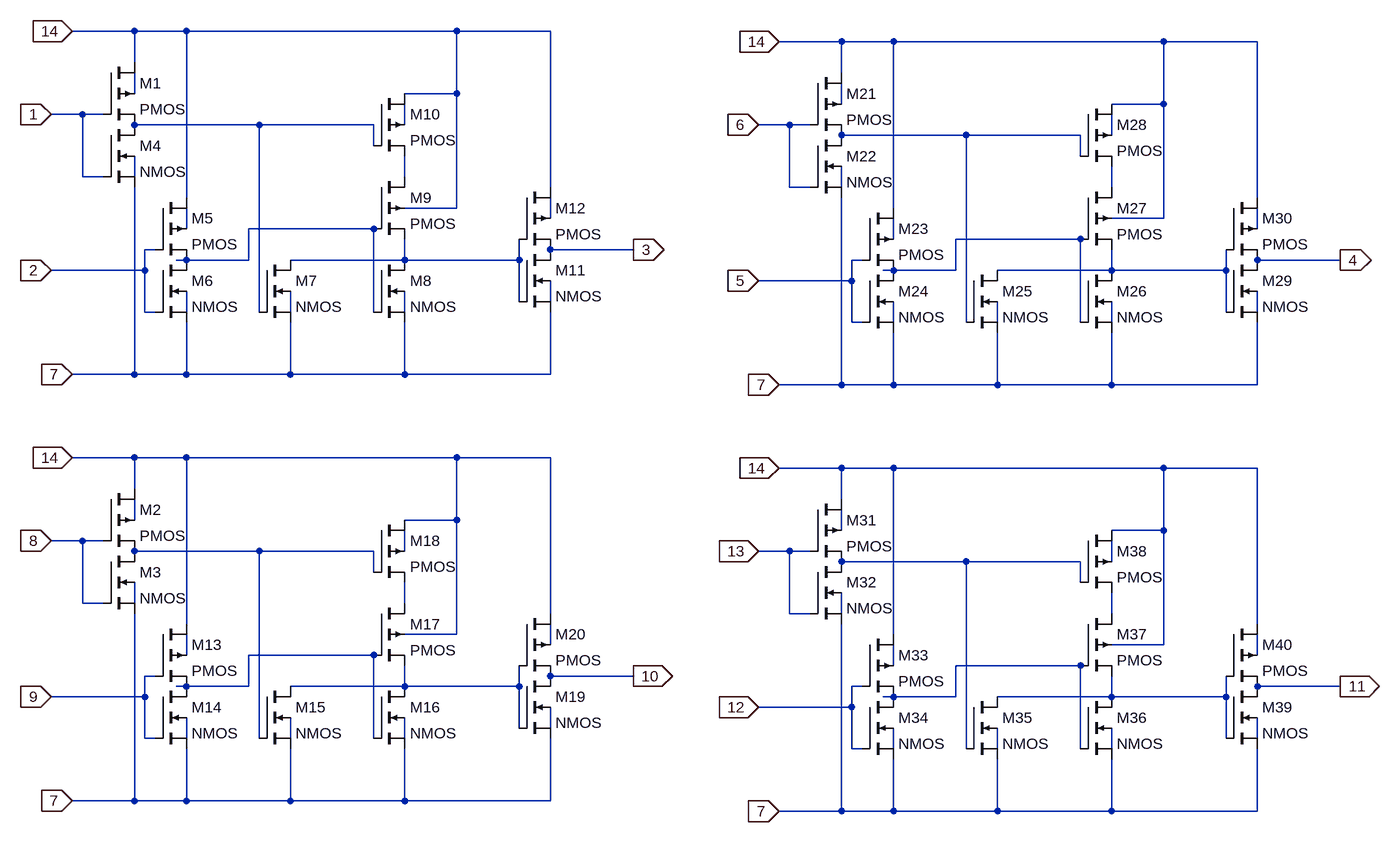
[diagram p0: schematic 4011_NAND.asc]
4011_NAND.asc, the LTspice schematic file:
Version 4
SHEET 1 2200 1208
WIRE 256 -64 160 -64
WIRE 336 -64 256 -64
WIRE 752 -64 336 -64
WIRE 896 -64 752 -64
WIRE 1344 -48 1248 -48
WIRE 1424 -48 1344 -48
WIRE 1840 -48 1424 -48
WIRE 1984 -48 1840 -48
WIRE 256 -16 256 -64
WIRE 1344 0 1344 -48
WIRE 256 32 256 0
WIRE 752 32 752 -64
WIRE 752 32 672 32
WIRE 1344 48 1344 16
WIRE 1840 48 1840 -48
WIRE 1840 48 1760 48
WIRE 176 64 128 64
WIRE 208 64 176 64
WIRE 448 80 256 80
WIRE 624 80 448 80
WIRE 672 80 672 48
WIRE 1264 80 1216 80
WIRE 1296 80 1264 80
WIRE 1536 96 1344 96
WIRE 1712 96 1536 96
WIRE 1760 96 1760 64
WIRE 624 112 624 80
WIRE 1712 128 1712 96
WIRE 176 160 176 64
WIRE 208 160 176 160
WIRE 256 160 256 128
WIRE 672 160 672 128
WIRE 896 176 896 -64
WIRE 1264 176 1264 80
WIRE 1296 176 1264 176
WIRE 1344 176 1344 144
WIRE 1760 176 1760 144
WIRE 336 192 336 -64
WIRE 1984 192 1984 -48
WIRE 752 208 752 32
WIRE 752 208 672 208
WIRE 1424 208 1424 -48
WIRE 896 224 896 192
WIRE 1840 224 1840 48
WIRE 1840 224 1760 224
WIRE 336 240 336 208
WIRE 624 240 432 240
WIRE 1984 240 1984 208
WIRE 1424 256 1424 224
WIRE 1712 256 1520 256
WIRE 288 272 272 272
WIRE 1024 272 896 272
WIRE 336 288 320 288
WIRE 432 288 432 240
WIRE 432 288 336 288
WIRE 672 288 672 256
WIRE 672 288 496 288
WIRE 848 288 848 256
WIRE 848 288 672 288
WIRE 1376 288 1360 288
WIRE 2112 288 1984 288
WIRE 272 304 272 272
WIRE 272 304 128 304
WIRE 1424 304 1408 304
WIRE 1520 304 1520 256
WIRE 1520 304 1424 304
WIRE 1760 304 1760 272
WIRE 1760 304 1584 304
WIRE 1936 304 1936 272
WIRE 1936 304 1760 304
WIRE 1360 320 1360 288
WIRE 1360 320 1216 320
WIRE 848 352 848 288
WIRE 896 352 896 320
WIRE 272 368 272 304
WIRE 288 368 272 368
WIRE 336 368 336 336
WIRE 448 368 448 80
WIRE 496 368 496 336
WIRE 624 368 624 240
WIRE 672 368 672 336
WIRE 1936 368 1936 304
WIRE 1984 368 1984 336
WIRE 1360 384 1360 320
WIRE 1376 384 1360 384
WIRE 1424 384 1424 352
WIRE 1536 384 1536 96
WIRE 1584 384 1584 352
WIRE 1712 384 1712 256
WIRE 1760 384 1760 352
WIRE 256 464 256 176
WIRE 256 464 160 464
WIRE 336 464 336 384
WIRE 336 464 256 464
WIRE 496 464 496 384
WIRE 496 464 336 464
WIRE 672 464 672 384
WIRE 672 464 496 464
WIRE 896 464 896 368
WIRE 896 464 672 464
WIRE 1344 480 1344 192
WIRE 1344 480 1248 480
WIRE 1424 480 1424 400
WIRE 1424 480 1344 480
WIRE 1584 480 1584 400
WIRE 1584 480 1424 480
WIRE 1760 480 1760 400
WIRE 1760 480 1584 480
WIRE 1984 480 1984 384
WIRE 1984 480 1760 480
WIRE 256 592 160 592
WIRE 336 592 256 592
WIRE 752 592 336 592
WIRE 896 592 752 592
WIRE 1344 608 1248 608
WIRE 1424 608 1344 608
WIRE 1840 608 1424 608
WIRE 1984 608 1840 608
WIRE 256 640 256 592
WIRE 1344 656 1344 608
WIRE 256 688 256 656
WIRE 752 688 752 592
WIRE 752 688 672 688
WIRE 1344 704 1344 672
WIRE 1840 704 1840 608
WIRE 1840 704 1760 704
WIRE 176 720 128 720
WIRE 208 720 176 720
WIRE 448 736 256 736
WIRE 624 736 448 736
WIRE 672 736 672 704
WIRE 1264 736 1216 736
WIRE 1296 736 1264 736
WIRE 1536 752 1344 752
WIRE 1712 752 1536 752
WIRE 1760 752 1760 720
WIRE 624 768 624 736
WIRE 1712 784 1712 752
WIRE 176 816 176 720
WIRE 208 816 176 816
WIRE 256 816 256 784
WIRE 672 816 672 784
WIRE 896 832 896 592
WIRE 1264 832 1264 736
WIRE 1296 832 1264 832
WIRE 1344 832 1344 800
WIRE 1760 832 1760 800
WIRE 336 848 336 592
WIRE 1984 848 1984 608
WIRE 752 864 752 688
WIRE 752 864 672 864
WIRE 1424 864 1424 608
WIRE 896 880 896 848
WIRE 1840 880 1840 704
WIRE 1840 880 1760 880
WIRE 336 896 336 864
WIRE 624 896 432 896
WIRE 1984 896 1984 864
WIRE 1424 912 1424 880
WIRE 1712 912 1520 912
WIRE 288 928 272 928
WIRE 1024 928 896 928
WIRE 336 944 320 944
WIRE 432 944 432 896
WIRE 432 944 336 944
WIRE 672 944 672 912
WIRE 672 944 496 944
WIRE 848 944 848 912
WIRE 848 944 672 944
WIRE 1376 944 1360 944
WIRE 2112 944 1984 944
WIRE 272 960 272 928
WIRE 272 960 128 960
WIRE 1424 960 1408 960
WIRE 1520 960 1520 912
WIRE 1520 960 1424 960
WIRE 1760 960 1760 928
WIRE 1760 960 1584 960
WIRE 1936 960 1936 928
WIRE 1936 960 1760 960
WIRE 1360 976 1360 944
WIRE 1360 976 1216 976
WIRE 848 1008 848 944
WIRE 896 1008 896 976
WIRE 272 1024 272 960
WIRE 288 1024 272 1024
WIRE 336 1024 336 992
WIRE 448 1024 448 736
WIRE 496 1024 496 992
WIRE 624 1024 624 896
WIRE 672 1024 672 992
WIRE 1936 1024 1936 960
WIRE 1984 1024 1984 992
WIRE 1360 1040 1360 976
WIRE 1376 1040 1360 1040
WIRE 1424 1040 1424 1008
WIRE 1536 1040 1536 752
WIRE 1584 1040 1584 1008
WIRE 1712 1040 1712 912
WIRE 1760 1040 1760 1008
WIRE 256 1120 256 832
WIRE 256 1120 160 1120
WIRE 336 1120 336 1040
WIRE 336 1120 256 1120
WIRE 496 1120 496 1040
WIRE 496 1120 336 1120
WIRE 672 1120 672 1040
WIRE 672 1120 496 1120
WIRE 896 1120 896 1024
WIRE 896 1120 672 1120
WIRE 1344 1136 1344 848
WIRE 1344 1136 1248 1136
WIRE 1424 1136 1424 1056
WIRE 1424 1136 1344 1136
WIRE 1584 1136 1584 1056
WIRE 1584 1136 1424 1136
WIRE 1760 1136 1760 1056
WIRE 1760 1136 1584 1136
WIRE 1984 1136 1984 1040
WIRE 1984 1136 1760 1136
FLAG 128 64 1
IOPIN 128 64 In
FLAG 160 -64 14
IOPIN 160 -64 In
FLAG 128 304 2
IOPIN 128 304 In
FLAG 160 464 7
IOPIN 160 464 In
FLAG 1024 272 3
IOPIN 1024 272 Out
FLAG 128 720 8
IOPIN 128 720 In
FLAG 160 592 14
IOPIN 160 592 In
FLAG 128 960 9
IOPIN 128 960 In
FLAG 160 1120 7
IOPIN 160 1120 In
FLAG 1024 928 10
IOPIN 1024 928 Out
FLAG 1216 80 6
IOPIN 1216 80 In
FLAG 1248 -48 14
IOPIN 1248 -48 In
FLAG 1216 320 5
IOPIN 1216 320 In
FLAG 1248 480 7
IOPIN 1248 480 In
FLAG 2112 288 4
IOPIN 2112 288 Out
FLAG 1216 736 13
IOPIN 1216 736 In
FLAG 1248 608 14
IOPIN 1248 608 In
FLAG 1216 976 12
IOPIN 1216 976 In
FLAG 1248 1136 7
IOPIN 1248 1136 In
FLAG 2112 944 11
IOPIN 2112 944 Out
SYMBOL pmos4 208 -16 R0
SYMATTR InstName M1
SYMBOL nmos4 208 80 R0
SYMATTR InstName M4
SYMBOL pmos4 288 192 R0
SYMATTR InstName M5
SYMBOL nmos4 288 288 R0
SYMATTR InstName M6
SYMBOL nmos4 448 288 R0
SYMATTR InstName M7
SYMBOL nmos4 624 288 R0
SYMATTR InstName M8
SYMBOL pmos4 624 160 R0
SYMATTR InstName M9
SYMBOL pmos4 624 32 R0
SYMATTR InstName M10
SYMBOL nmos4 848 272 R0
SYMATTR InstName M11
SYMBOL pmos4 848 176 R0
SYMATTR InstName M12
SYMBOL pmos4 208 640 R0
SYMATTR InstName M2
SYMBOL nmos4 208 736 R0
SYMATTR InstName M3
SYMBOL pmos4 288 848 R0
SYMATTR InstName M13
SYMBOL nmos4 288 944 R0
SYMATTR InstName M14
SYMBOL nmos4 448 944 R0
SYMATTR InstName M15
SYMBOL nmos4 624 944 R0
SYMATTR InstName M16
SYMBOL pmos4 624 816 R0
SYMATTR InstName M17
SYMBOL pmos4 624 688 R0
SYMATTR InstName M18
SYMBOL nmos4 848 928 R0
SYMATTR InstName M19
SYMBOL pmos4 848 832 R0
SYMATTR InstName M20
SYMBOL pmos4 1296 0 R0
SYMATTR InstName M21
SYMBOL nmos4 1296 96 R0
SYMATTR InstName M22
SYMBOL pmos4 1376 208 R0
SYMATTR InstName M23
SYMBOL nmos4 1376 304 R0
SYMATTR InstName M24
SYMBOL nmos4 1536 304 R0
SYMATTR InstName M25
SYMBOL nmos4 1712 304 R0
SYMATTR InstName M26
SYMBOL pmos4 1712 176 R0
SYMATTR InstName M27
SYMBOL pmos4 1712 48 R0
SYMATTR InstName M28
SYMBOL nmos4 1936 288 R0
SYMATTR InstName M29
SYMBOL pmos4 1936 192 R0
SYMATTR InstName M30
SYMBOL pmos4 1296 656 R0
SYMATTR InstName M31
SYMBOL nmos4 1296 752 R0
SYMATTR InstName M32
SYMBOL pmos4 1376 864 R0
SYMATTR InstName M33
SYMBOL nmos4 1376 960 R0
SYMATTR InstName M34
SYMBOL nmos4 1536 960 R0
SYMATTR InstName M35
SYMBOL nmos4 1712 960 R0
SYMATTR InstName M36
SYMBOL pmos4 1712 832 R0
SYMATTR InstName M37
SYMBOL pmos4 1712 704 R0
SYMATTR InstName M38
SYMBOL nmos4 1936 944 R0
SYMATTR InstName M39
SYMBOL pmos4 1936 848 R0
SYMATTR InstName M40

The netlist it stands for:
* 4011_NAND.asc
M1 14 1 N003 N001 PMOS
M4 N003 1 7 N007 NMOS
M5 14 2 N013 N012 PMOS
M6 N013 2 7 N020 NMOS
M7 N017 N003 7 N021 NMOS
M8 N017 N013 7 N022 NMOS
M9 N008 N013 N017 14 PMOS
M10 14 N003 N008 N004 PMOS
M11 3 N017 7 N019 NMOS
M12 14 N017 3 N011 PMOS
M2 14 8 N029 N027 PMOS
M3 N029 8 7 N033 NMOS
M13 14 9 N039 N038 PMOS
M14 N039 9 7 N046 NMOS
M15 N043 N029 7 N047 NMOS
M16 N043 N039 7 N048 NMOS
M17 N034 N039 N043 14 PMOS
M18 14 N029 N034 N030 PMOS
M19 10 N043 7 N045 NMOS
M20 14 N043 10 N037 PMOS
M21 14 6 N005 N002 PMOS
M22 N005 6 7 N009 NMOS
M23 14 5 N016 N015 PMOS
M24 N016 5 7 N024 NMOS
M25 N018 N005 7 N025 NMOS
M26 N018 N016 7 N026 NMOS
M27 N010 N016 N018 14 PMOS
M28 14 N005 N010 N006 PMOS
M29 4 N018 7 N023 NMOS
M30 14 N018 4 N014 PMOS
M31 14 13 N031 N028 PMOS
M32 N031 13 7 N035 NMOS
M33 14 12 N042 N041 PMOS
M34 N042 12 7 N050 NMOS
M35 N044 N031 7 N051 NMOS
M36 N044 N042 7 N052 NMOS
M37 N036 N042 N044 14 PMOS
M38 14 N031 N036 N032 PMOS
M39 11 N044 7 N049 NMOS
M40 14 N044 11 N040 PMOS
.model NMOS NMOS
.model PMOS PMOS
.lib standard.mos
.backanno
.end